# EAGLE design base-enc28j60 (EAGLE 5.09)
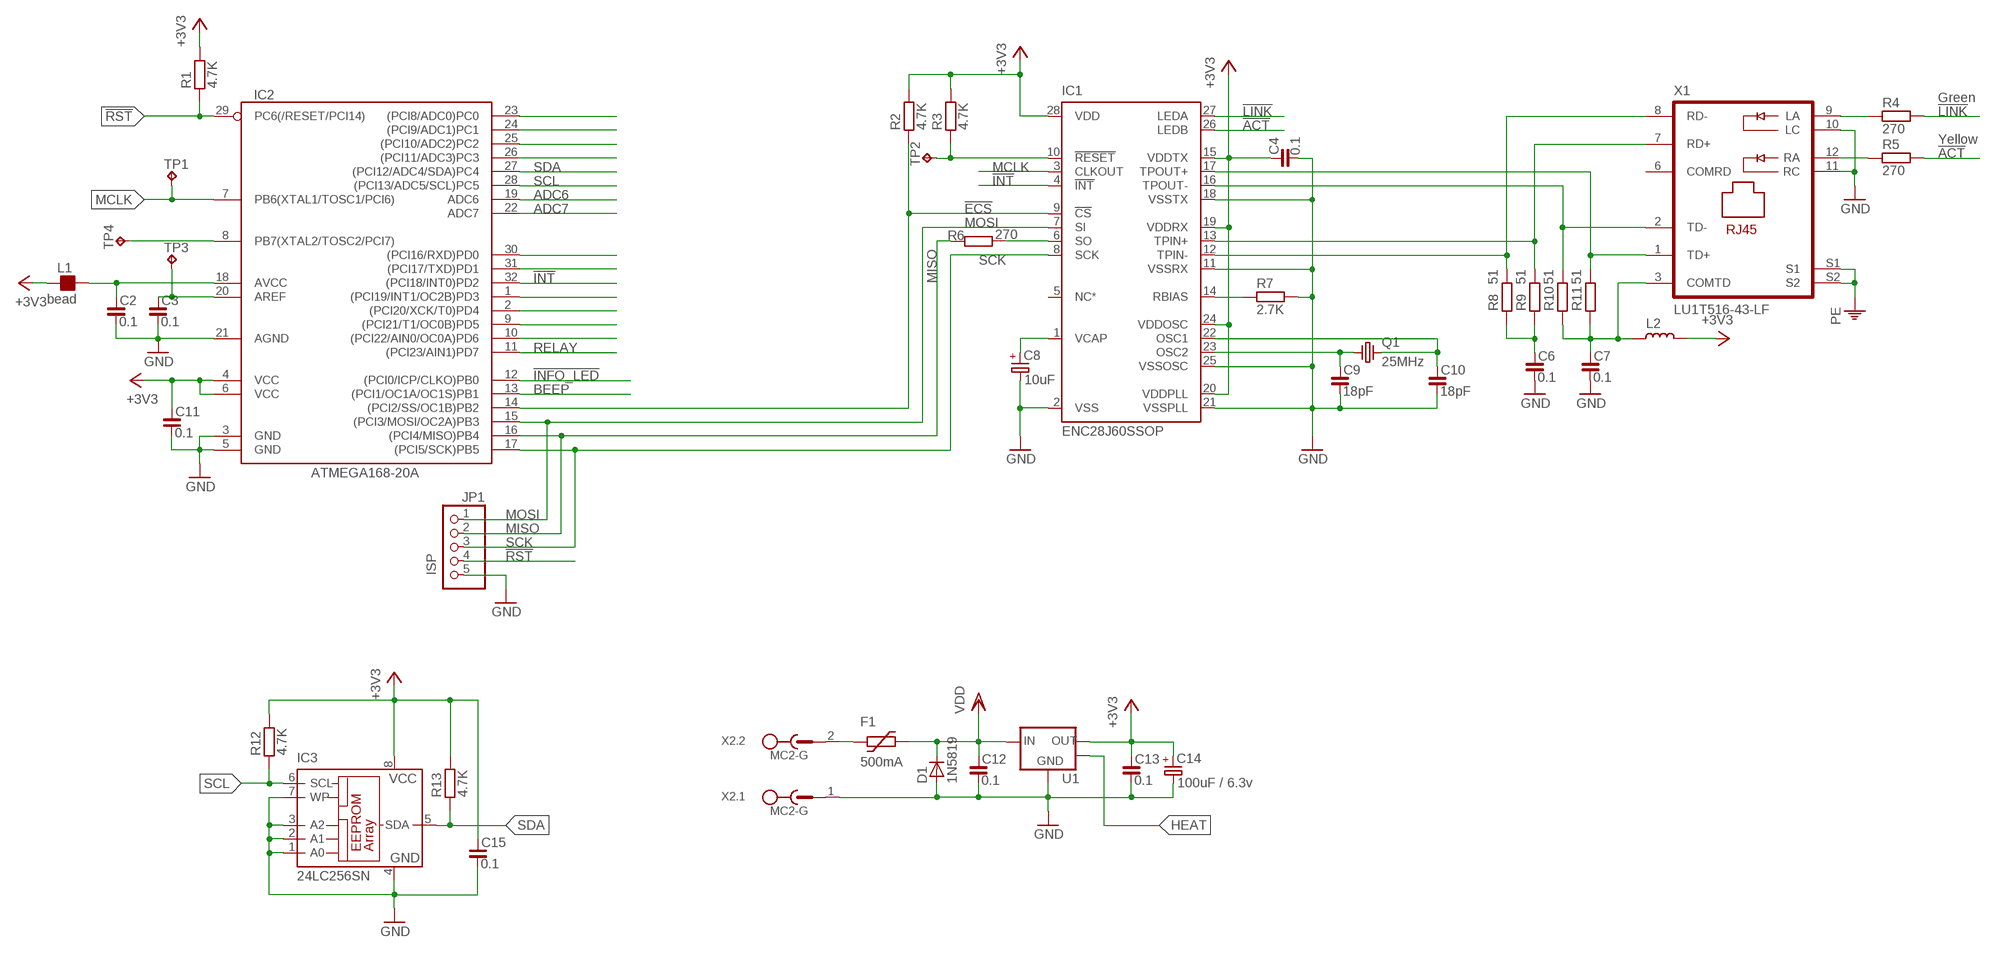
[diagram p0: schematic, sheet 1]

## Parts
C2  0.1  C_0805  [C0805]
C3  0.1  C_0805  [C0805]
C4  0.1  C_0805  [C0805]
C6  0.1  C_0805  [C0805]
C7  0.1  C_0805  [C0805]
C8  10uF  CP_SMCA  [SMC_A]
C9  18pF  C_0805  [C0805]
C10  18pF  C_0805  [C0805]
C11  0.1  C_0805  [C0805]
C12  0.1  C_0805  [C0805]
C13  0.1  C_0805  [C0805]
C14  100uF / 6.3v  CP_SMCB  [SMC_B]
C15  0.1  C_0805  [C0805]
D1  1N5819  D-MLL-41  [MELF-MLL41]
F1  500mA  1812L  [1812L]
IC1  ENC28J60SSOP  [SSOP28]
IC2  ATMEGA168-20A  [TQFP32-08]
IC3  24LC256SN  [SO-08]
JP1  PINHD-1X5_2.00  [1X05M]
L1  bead  FB_0805  [L0805]
L2  L_1206  [L1206]
Q1  25MHz  CRYSTAL-HC49S  [HC49/S]
R1  4.7K  R_0805  [R0805]
R2  4.7K  R_0805  [R0805]
R3  4.7K  R_0805  [R0805]
R4  270  R_0805  [R0805]
R5  270  R_0805  [R0805]
R6  270  R_0805  [R0805]
R7  2.7K  R_0805  [R0805]
R8  51  R_0805  [R0805]
R9  51  R_0805  [R0805]
R10  51  R_0805  [R0805]
R11  51  R_0805  [R0805]
R12  4.7K  R_0805  [R0805]
R13  4.7K  R_0805  [R0805]
TP1  TPB1,27  [B1,27]
TP2  TPB1,27  [B1,27]
TP3  TPB1,27  [B1,27]
TP4  TPB1,27  [B1,27]
U1  LM1117-3.3  [SOT223]
X1  LU1T516-43-LF  [PJ-J0]
X2  MC2-G  [MC2-G]

## Nets
!ACT: IC1.26(LEDB) R5.2
!ECS: IC1.9(!CS) IC2.14((PCI2/SS/OC1B)PB2) R2.1
!INFO_LED: IC2.12((PCI0/ICP/CLKO)PB0)
!INT: IC1.4(!INT) IC2.32((PCI18/INT0)PD2)
!LINK: IC1.27(LEDA) R4.2
!RST: IC2.29(PC6(/RESET/PCI14)) JP1.4 R1.1
+3V3: C4.1 C11.1 C13.1 C14.+ C15.1 IC1.15(VDDTX) IC1.19(VDDRX) IC1.20(VDDPLL) IC1.24(VDDOSC) IC1.28(VDD) IC2.4(VCC) IC2.6(VCC) IC3.8(VCC) L1.1 L2.1 R1.2 R2.2 R3.2 R12.2 R13.2 U1.2(OUT)
ADC6: IC2.19(ADC6)
ADC7: IC2.22(ADC7)
BEEP: IC2.13((PCI1/OC1A/OC1S)PB1)
GND: C2.2 C3.2 C4.2 C6.2 C7.2 C8.- C9.2 C10.2 C11.2 C12.2 C13.2 C14.- C15.2 D1.A IC1.2(VSS) IC1.11(VSSRX) IC1.18(VSSTX) IC1.21(VSSPLL) IC1.25(VSSOSC) IC2.3(GND) IC2.5(GND) IC2.21(AGND) IC3.1(A0) IC3.2(A1) IC3.3(A2) IC3.4(GND) IC3.7(WP) JP1.5 R7.2 U1.1(GND) X1.10(LC) X1.11(RC) X2.1
HEAT: U1.4(MASS)
MCLK: IC1.3(CLKOUT) IC2.7(PB6(XTAL1/TOSC1/PCI6)) TP1.PP(TP)
MISO: IC2.16((PCI4/MISO)PB4) JP1.2 R6.1
MOSI: IC1.7(SI) IC2.15((PCI3/MOSI/OC2A)PB3) JP1.1
N$1: F1.P$1 X2.2
N$2: C6.1 R8.1 R9.1
N$3: C8.+ IC1.1(VCAP)
N$4: C3.1 IC2.20(AREF) TP3.PP(TP)
N$5: IC2.23((PCI8/ADC0)PC0)
N$6: C2.1 IC2.18(AVCC) L1.2
N$7: IC1.14(RBIAS) R7.1
N$8: C10.1 IC1.22(OSC1) Q1.2
N$9: C9.1 IC1.23(OSC2) Q1.1
N$10: R4.1 X1.9(LA)
N$11: R5.1 X1.12(RA)
N$12: IC1.17(TPOUT+) R11.2 X1.1(TD+)
N$13: IC1.10(!RESET) R3.1 TP2.PP(TP)
N$14: IC2.24((PCI9/ADC1)PC1)
N$15: IC2.25((PCI10/ADC2)PC2)
N$16: IC1.6(SO) R6.2
N$17: IC2.26((PCI11/ADC3)PC3)
N$18: IC2.30((PCI16/RXD)PD0)
N$19: IC2.31((PCI17/TXD)PD1)
N$20: IC2.1((PCI19/INT1/OC2B)PD3)
N$21: IC2.2((PCI20/XCK/T0)PD4)
N$22: IC2.9((PCI21/T1/OC0B)PD5)
N$23: IC2.10((PCI22/AIN0/OC0A)PD6)
N$24: IC2.8(PB7(XTAL2/TOSC2/PCI7)) TP4.PP(TP)
PE: X1.S1 X1.S2
PWFBOUT: C7.1 L2.2 R10.1 R11.1 X1.3(COMTD)
RELAY: IC2.11((PCI23/AIN1)PD7)
SCK: IC1.8(SCK) IC2.17((PCI5/SCK)PB5) JP1.3
SCL: IC2.28((PCI13/ADC5/SCL)PC5) IC3.6(SCL) R12.1
SDA: IC2.27((PCI12/ADC4/SDA)PC4) IC3.5(SDA) R13.1
TPRX+: IC1.13(TPIN+) R9.2 X1.7(RD+)
TPRX-: IC1.12(TPIN-) R8.2 X1.8(RD-)
TPTX-: IC1.16(TPOUT-) R10.2 X1.2(TD-)
VDD: C12.1 D1.C F1.P$2 U1.3(IN)
Unconnected: IC1.5(NC*) X1.6(COMRD)

## Notes on the sheet
- Green
- Yellow
- ISP

## Library data of the parts
C2-C4 C6 C7 C9-C13 C15 = rc-master-smd:C_: NON-POLARIZED CAP
C8 C14 = rc-master-smd:CP_: POLARIZED CAP
D1 = semicon-smd-ipc:D-: DIODE unfilled
F1 = discrete:1812L
IC1 = microchip-6:ENC28J60: Stand-Alone Ethernet Controller with SPI Interface Source: http://ww1.microchip.com/downloads/en/DeviceDoc/39662c.pdf
IC2 = avr:ATMEGA168: MICROCONTROLLER 16 kBytes FLASH 1 kBytes SRAM 512 Bytes EEPROM USART 8-channel 10 bit ADC
IC3 = microchip-6:24*: Serial EEPROM I2C
JP1 = pinhead-fixdrills:PINHD-1X5: PIN HEADER
L1 = rc-master-smd:FB_: FERRITE BEAD
L2 = rc-master-smd:L_: INDUCTOR
Q1 = crystal:CRYSTAL-: CRYSTAL
R1-R13 = rc-master-smd:R_: RESISTOR
TP1-TP4 = testpad:TP: Test pad
U1 = vreg-linear:LM1117: Linear regulators
X1 = con-magjack:LU1T516-43-LF: 8P8C (RJ-45) MagJack connector Can be replaced with LU1T041X
X2 = con-phoenix-381_l:MC2-G: Mini-Combicon 3.81mm horizontal 2-polig (mit Gegenstecker)

## Board
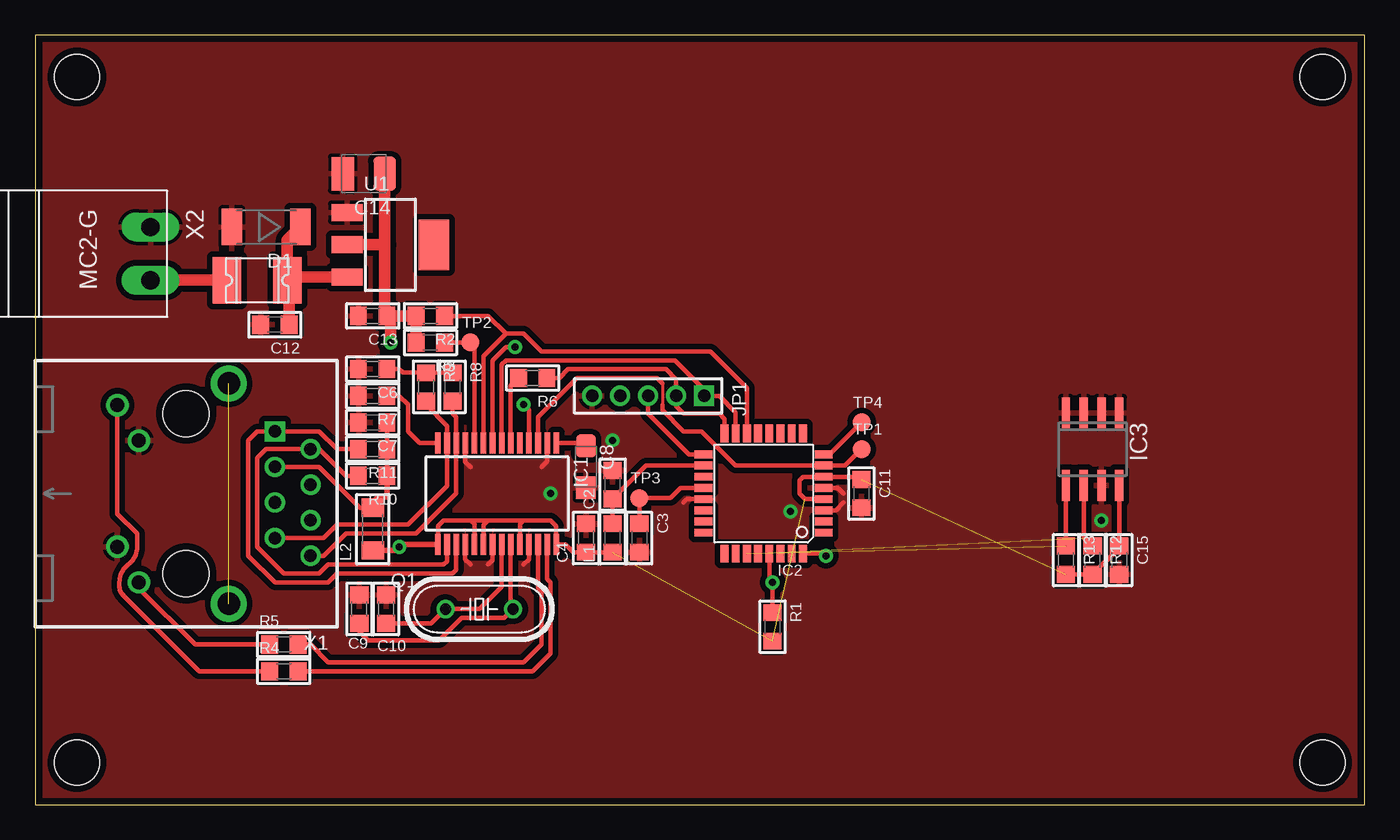
[diagram p1: board, top side]
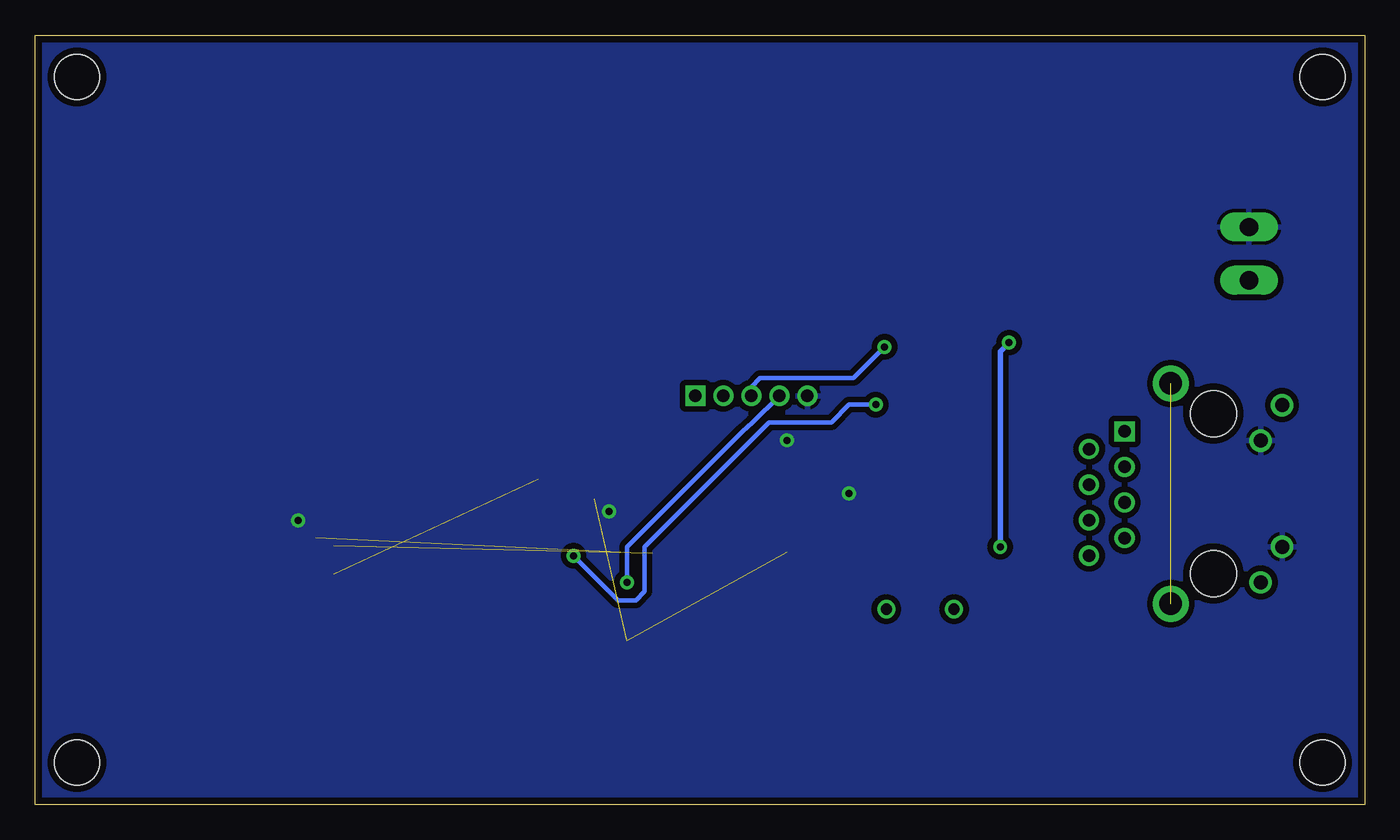
[diagram p2: board, bottom side, seen from below]

Size 95 x 55 mm. Coordinates in mm from the lower left corner, seen from the top.
Outline: 0,0 95,0 95,55 0,55 0,0
Copper layers (1*16): Top 0.018mm / dielectric 1.5011mm / Bottom 0.018mm
Design rules "resonit-speed-18mkm *": minimum track width 0.2mm, minimum drill 0.5mm, track to track 0.15mm, track to pad 0.15mm, pad to pad 0.15mm, via to via 0.15mm, smd to smd 0.15mm, copper to edge 0.5mm, drill to drill 8mil, minimum pad ring 0.2489mm, minimum via ring 0.2489mm, stop-mask expansion 4mil, vias tented up to drill 0.5994mm, thermal gap 10mil
Holes 3.2 mm at 3,3 3,52 92,52 92,3

### Footprints (pad centres in the part's own frame; a part is rotated, then mirrored left to right if it is on the bottom)
C0805 = smd 1.2 x 1.3: 1 -1.016,0; 2 1.016,0
SMC_A = smd 1.6 x 1.4: + -1.5,0; - 1.5,0
SMC_B = smd 1.6 x 2.4: + -1.5,0; - 1.5,0
MELF-MLL41 = smd 1.45 x 2.6: A 2.445,0; C -2.445,0
1812L = smd 2.03 x 3.3: P$1 -2.16,0; P$2 2.16,0
SSOP28 = smd 0.4 x 1.5: 1 -4.225,-3.625; 2 -3.575,-3.625; 3 -2.925,-3.625; 4 -2.275,-3.625; 5 -1.625,-3.625; 6 -0.975,-3.625; 7 -0.325,-3.625; 8 0.325,-3.625; 9 0.975,-3.625; 10 1.625,-3.625; 11 2.275,-3.625; 12 2.925,-3.625; 13 3.575,-3.625; 14 4.225,-3.625; 15 4.225,3.625; 16 3.575,3.625; 17 2.925,3.625; 18 2.275,3.625; 19 1.625,3.625; 20 0.975,3.625; 21 0.325,3.625; 22 -0.325,3.625; 23 -0.975,3.625; 24 -1.625,3.625; 25 -2.275,3.625; 26 -2.925,3.625; 27 -3.575,3.625; 28 -4.225,3.625
TQFP32-08 = smd 1.27 x 0.559: 1 -4.293,2.8; 2 -4.293,2; 3 -4.293,1.2; 4 -4.293,0.4; 5 -4.293,-0.4; 6 -4.293,-1.2; 7 -4.293,-2; 8 -4.293,-2.8; 17 4.293,-2.8; 18 4.293,-2; 19 4.293,-1.2; 20 4.293,-0.4; 21 4.293,0.4; 22 4.293,1.2; 23 4.293,2; 24 4.293,2.8 | smd 0.559 x 1.27: 9 -2.8,-4.293; 10 -2,-4.293; 11 -1.2,-4.293; 12 -0.4,-4.293; 13 0.4,-4.293; 14 1.2,-4.293; 15 2,-4.293; 16 2.8,-4.293; 25 2.8,4.293; 26 2,4.293; 27 1.2,4.293; 28 0.4,4.293; 29 -0.4,4.293; 30 -1.2,4.293; 31 -2,4.293; 32 -2.8,4.293
SO-08 = smd 0.6 x 2.2: 1 -1.905,-2.6; 2 -0.635,-2.6; 3 0.635,-2.6; 4 1.905,-2.6; 5 1.905,2.6; 6 0.635,2.6; 7 -0.635,2.6; 8 -1.905,2.6
1X05M = drill 0.9 square: 1 -4,0 | drill 0.9 round: 2 -2,0; 3 0,0; 4 2,0; 5 4,0
L0805 = smd 1.2 x 1.3: 1 -1.016,0; 2 1.016,0
L1206 = smd 1.3 x 1.6: 1 -1.524,0; 2 1.524,0
HC49/S = drill 0.8 round: 1 -2.413,0; 2 2.413,0
R0805 = smd 1.2 x 1.3: 1 -1.016,0; 2 1.016,0
B1,27 = smd 1.27 x 1.27: PP 0,0
SOT223 = smd 1.219 x 2.235: 1 -2.311,-3.099; 2 0,-3.099; 3 2.311,-3.099 | smd 3.6 x 2.2: 4 0,3.099
PJ-J0 = drill 0.9 square: 1 4.445,-6.35 | drill 0.9 round: 2 3.175,-8.89; 3 1.905,-6.35; 4 0.635,-8.89; 5 -0.635,-6.35; 6 -1.905,-8.89; 7 -3.175,-6.35; 8 -4.445,-8.89 | drill 1 round: 9 6.325,4.902; 10 3.785,3.378; 11 -3.81,4.902; 12 -6.35,3.378 | drill 1.6 round: S1 -7.874,-3.048; S2 7.874,-3.048 | hole 3.3: -5.715,0; 5.715,0
MC2-G = drill 1.3 long: 1 -1.905,0; 2 1.905,0

### Placement (x,y rotation side)
C2  41.27,22.86 90 top
C3  43.18,19.05 270 top
C4  39.37,19.05 90 top
C6  24.13,31.11 180 top
C7  24.13,27.3 180 top
C8  39.37,24.13 270 top
C9  23.18,13.97 90 top
C10  25.08,13.97 90 top
C11  59.05,22.23 270 top
C12  17.14,34.29 180 top
C13  24.13,34.92 180 top
C14  23.5,45.09 180 top
C15  77.47,17.46 270 top
D1  16.51,41.27 180 top
F1  15.88,37.47 0 top
IC1  33.02,22.23 180 top
IC2  52.07,22.23 180 top
IC3  75.56,25.4 180 top
JP1  43.81,29.21 180 top
L1  41.27,19.05 90 top
L2  24.13,19.68 90 top
Q1  31.75,13.97 180 top
R1  52.7,12.7 270 top
R2  28.26,34.92 180 top
R3  28.26,33.02 180 top
R4  17.78,9.53 0 top
R5  17.78,11.43 0 top
R6  35.56,30.48 180 top
R7  24.13,29.21 180 top
R8  29.84,29.84 270 top
R9  27.94,29.84 270 top
R10  24.13,23.5 180 top
R11  24.13,25.4 180 top
R12  75.56,17.46 270 top
R13  73.66,17.46 270 top
TP1  59.05,25.4 0 top
TP2  31.11,33.02 0 top
TP3  43.18,21.91 0 top
TP4  59.05,27.3 0 top
U1  25.4,40.01 270 top
X1  10.79,22.23 90 top
X2  8.26,39.37 270 top

### Tracks (layer width: path | path; a pad name or v marks a point on that pad's centre or on a via)
!ACT
  Top 0.305: R5.2 19.68,11.43 20.95,10.16 34.92,10.16 36.2,11.43 36.2,15.24 35.95,15.49 IC1.26
!ECS
  Top 0.305: IC1.9 32.05,32.05 33.66,33.66 | 33.66,33.66 34.92,33.66 36.2,32.38 48.26,32.38 50.87,29.77 IC2.14 | R2.1 32.38,34.92 33.66,33.66
!INT  (via drill 0.5)
  Top 0.305: IC1.4 35.3,28.2 v34.92,28.57 | IC2.32 56.36,17.93 v56.52,17.78
  Bottom 0.305: v34.92,28.57 36.83,28.57 38.1,27.3 42.55,27.3 51.44,18.41 51.44,15.24 52.07,14.61 53.34,14.61 v56.52,17.78
!LINK
  Top 0.305: R4.2 35.56,9.53 36.83,10.79 36.83,15.88 36.59,16.11 IC1.27
!RST  (via drill 0.5)
  Top 0.305: IC2.29 52.47,16.11 v52.7,15.88 R1.1
  Bottom 0.305: v52.7,15.88 52.7,18.41 44.45,26.67 43.72,27.3 JP1.4
+3V3  (via drill 0.5)  (3 unrouted)
  Top 0.305: IC1.15 28.8,19.91 29.21,20.32 31.11,20.32 | 31.11,20.32 32.38,20.32 | 32.38,20.32 34.92,20.32 | 34.92,20.32 36.83,20.32 37.24,19.91 IC1.28 37.91,18.6 38.48,18.03 C4.1 L1.1 | IC1.20 32.05,19.98 32.38,20.32 | IC1.19 31.39,20.04 31.11,20.32 | IC1.24 34.65,20.04 34.92,20.32 | IC2.4 55.01,21.82 54.61,22.23 54.61,23.18 54.86,23.43 IC2.6 58.87,23.43 C11.1 | R13.2 R12.2 77.47,18.35 C15.1 IC3.8
  Top 0.406: L2.1 25.78,18.16 v26.04,18.41 26.22,18.6 IC1.15
  Top 0.813: 25.4,34.92 C13.1 25,35.08 25,40.01 | 25.4,34.92 R2.2 R3.2 | 25,40.01 C14.+ | 25,40.01 U1.2 | v25.4,33.02 25.4,34.92
  Bottom 0.406: v26.04,18.41 26.04,32.38 v25.4,33.02
GND  (via drill 0.5)
  Top 0.305: IC1.18 30.75,17.52 31.11,17.14 | IC1.21 32.7,17.45 32.38,17.14 | IC1.25 35.3,17.52 34.92,17.14 | IC1.11 30.75,24.5 31.11,24.13 | IC1.2 36.59,24.53 36.2,24.13 | IC2.5 57.38,22.62 57.78,22.23 | IC2.3 57.22,21.02 57.78,21.59 | IC2.21 46.59,21.82 46.35,21.59
  other vias: 36.83,22.23 41.27,26.04 76.2,20.32 53.98,20.95
  pour Top (isolate 0.406): -1.27,56.52 96.52,56.52 96.52,-1.27 -1.27,-1.27
  pour Bottom (isolate 0.406): -1.27,56.52 96.52,56.52 96.52,-1.27 -1.27,-1.27
MCLK
  Top 0.21: 44.83,30.1 44.83,28.55
  Top 0.305: IC1.3 35.95,27.69 38.73,30.48 44.45,30.48 44.83,30.1 | 44.83,28.55 44.83,28.19 46.35,26.67 47.62,26.67 50.07,24.23 IC2.7 57.88,24.23 TP1.PP
MISO
  Top 0.305: JP1.2 45.81,30.39 45.09,31.11 38.1,31.11 37.47,30.48 R6.1 | JP1.2 45.81,29.75 | IC2.16 49.27,27.57 48.9,27.94 46.35,27.94 45.81,28.48 JP1.2
MOSI
  Top 0.305: IC1.7 33.34,31.44 33.66,31.75 45.72,31.75 47.81,29.66 JP1.1 48.9,29.21 50.07,28.04 IC2.15
N$1
  Top 0.813: X2.2 F1.P$1
N$2
  Top 0.305: R8.1 R9.1 26.29,30.86 26.04,31.11 C6.1
N$3
  Top 0.305: IC1.1 39.15,25.85 C8.+
N$4
  Top 0.305: C3.1 TP3.PP 45.4,21.91 46.12,22.62 IC2.20
N$6
  Top 0.305: L1.2 C2.1 43.66,24.23 IC2.18
N$7
  Top 0.305: IC1.14 27.49,25.85 26.67,26.67 26.67,28.57 26.04,29.21 R7.1
N$8
  Top 0.305: IC1.22 33.34,15.56 31.75,13.97 Q1.2 28.32,12.95 C10.1
N$9
  Top 0.305: IC1.23 33.99,14.12 Q1.1 33.53,13.34 30.48,13.34 28.89,11.75 23.81,11.75 23.18,12.38 C9.1
N$10
  Top 0.305: X1.9 5.89,20.78 7.3,19.37 7.3,18.41 arc-53 6.67,17.14 arc53 6.03,15.88 6.03,15.56 arc53 6.35,14.92 11.75,9.53 R4.1
N$11
  Top 0.305: R5.1 11.43,11.43 7.42,15.44 X1.12
N$12
  Top 0.305: IC1.17 30.09,16.76 29.84,16.51 21.59,16.51 20.95,15.88 17.14,15.88 15.24,17.78 15.24,26.04 15.88,26.67 X1.1 20.32,26.67 21.59,25.4 R11.2
N$13
  Top 0.305: IC1.10 31.39,32.74 TP2.PP R3.1
N$16
  Top 0.305: IC1.6 33.99,29.93 R6.2
N$24
  Top 0.305: IC2.8 56.77,25.02 TP4.PP
PE  (1 unrouted)
PWFBOUT
  Top 0.305: R10.1 R11.1 C7.1 | X1.3 20.32,24.13 23.24,21.21 L2.2
  Top 0.406: R10.1 25.15,21.97 24.38,21.84 L2.2
SCK  (via drill 0.5)
  Top 0.305: IC1.8 32.7,31.74 33.66,32.7 v34.29,32.7 | IC2.17 46.73,25.02 43.81,27.94 JP1.3
  Bottom 0.305: JP1.3 43.81,29.84 43.18,30.48 36.51,30.48 v34.29,32.7
SCL  (1 unrouted)
  Top 0.305: R12.1 75.5,18.48 74.93,19.05 IC3.6
SDA  (1 unrouted)
  Top 0.305: R13.1 IC3.5
TPRX+
  Top 0.305: X1.7 20.64,19.05 21.59,20 26.67,20 29.45,22.78 IC1.13 29.45,27.07 27.94,28.57 R9.2
TPRX-
  Top 0.305: X1.8 20.64,17.78 22.23,19.37 27.24,19.37 30.09,22.23 IC1.12 30.09,27.69 29.84,27.94 R8.2
TPTX-
  Top 0.305: IC1.16 29.45,17.38 29.21,17.14 20.95,17.14 20.32,16.51 17.78,16.51 15.88,18.41 15.88,24.77 16.51,25.4 X1.2 20.32,25.4 22.23,23.5 R10.2
VDD
  Top 0.813: F1.P$2 18.04,40.35 D1.C | C12.1 18.16,37.34 F1.P$2 | U1.3 18.26,37.69 F1.P$2